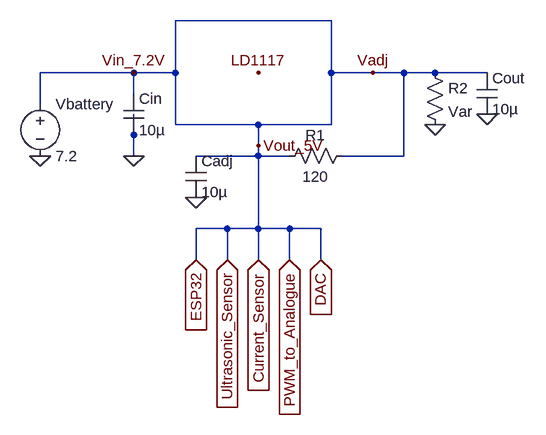
[diagram p0: schematic MockCircuit.asc]
MockCircuit.asc, the LTspice schematic file:
Version 4
SHEET 1 880 792
WIRE 432 16 192 16
WIRE 128 96 -16 96
WIRE 192 96 192 16
WIRE 192 96 128 96
WIRE 432 96 432 16
WIRE 496 96 432 96
WIRE 544 96 496 96
WIRE 592 96 544 96
WIRE 672 96 592 96
WIRE 128 128 128 96
WIRE -16 144 -16 96
WIRE 192 176 192 96
WIRE 320 176 192 176
WIRE 432 176 432 96
WIRE 432 176 320 176
WIRE 128 192 128 160
WIRE 320 208 320 176
WIRE 128 224 128 192
WIRE 320 224 320 208
WIRE 320 224 224 224
WIRE 368 224 320 224
WIRE 544 224 544 96
WIRE 544 224 448 224
WIRE 272 336 224 336
WIRE 320 336 320 224
WIRE 320 336 272 336
WIRE 368 336 320 336
WIRE 416 336 368 336
WIRE 224 384 224 336
WIRE 272 384 272 336
WIRE 320 384 320 336
WIRE 368 384 368 336
WIRE 416 384 416 336
FLAG -16 224 0
FLAG 320 96 LD1117
FLAG 592 176 0
FLAG 672 160 0
FLAG 224 288 0
FLAG 224 384 ESP32
IOPIN 224 384 In
FLAG 272 384 Ultrasonic_Sensor
IOPIN 272 384 In
FLAG 320 384 Current_Sensor
IOPIN 320 384 In
FLAG 368 384 PWM_to_Analogue
IOPIN 368 384 In
FLAG 416 384 DAC
IOPIN 416 384 In
FLAG 128 96 Vin_7.2V
FLAG 128 224 0
FLAG 496 96 Vadj
FLAG 320 208 Vout_5V
SYMBOL voltage -16 128 R0
SYMATTR InstName Vbattery
SYMATTR Value 7.2
SYMBOL cap 112 128 R0
SYMATTR InstName Cin
SYMATTR Value 10µ
SYMBOL res 464 208 R90
WINDOW 0 0 56 VBottom 2
WINDOW 3 32 56 VTop 2
SYMATTR InstName R1
SYMATTR Value 120
SYMBOL res 576 80 R0
SYMATTR InstName R2
SYMATTR Value Var
SYMBOL cap 656 96 R0
SYMATTR InstName Cout
SYMATTR Value 10µ
SYMBOL cap 208 224 R0
SYMATTR InstName Cadj
SYMATTR Value 10µ

The netlist it stands for:
* MockCircuit.asc
Vbattery Vout_5V 0 7.2
Cin Vout_5V 0 10µ
R1 Vout_5V Vout_5V 120
R2 Vout_5V 0 Var
Cout Vout_5V 0 10µ
Cadj Vout_5V 0 10µ
.backanno
.end